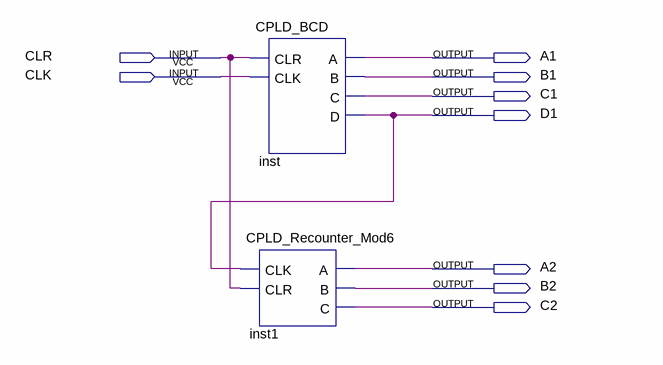
[diagram p0: schematic sheet]
// Quartus schematic CPLD_Mod60.bdf as structural Verilog: 2 symbols, 9 pins
module CPLD_Mod60 (
  input  CLR,
  input  CLK,
  output A1,
  output B1,
  output C1,
  output D1,
  output A2,
  output B2,
  output C2
);

  CPLD_BCD inst (.CLR(CLR), .CLK(CLK), .A(A1), .B(B1), .C(C1), .D(D1));
  CPLD_Recounter_Mod6 inst1 (.CLK(D1), .CLR(CLR), .A(A2), .B(B2), .C(C2));
endmodule
